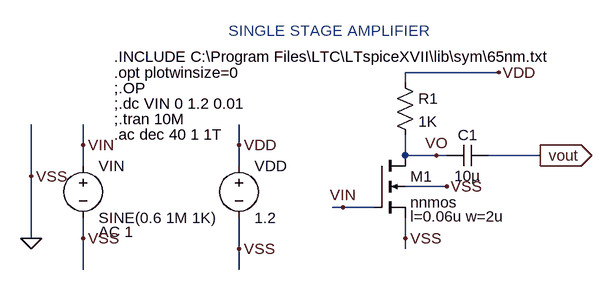
[diagram p0: schematic 8SINGLE STAGE AMPLIFIER.asc]
8SINGLE STAGE AMPLIFIER.asc, the LTspice schematic file:
Version 4
SHEET 1 880 680
WIRE 480 48 336 48
WIRE 336 64 336 48
WIRE -160 160 -160 128
WIRE 80 160 80 128
WIRE 336 176 336 144
WIRE 384 176 336 176
WIRE 400 176 384 176
WIRE 544 176 464 176
WIRE -160 192 -160 160
WIRE 80 192 80 160
WIRE -240 208 -240 128
WIRE 400 224 336 224
WIRE 240 256 224 256
WIRE 288 256 240 256
WIRE -240 304 -240 208
WIRE -160 304 -160 272
WIRE 336 304 336 272
WIRE 80 320 80 272
WIRE 336 320 336 304
WIRE -160 352 -160 304
WIRE 80 352 80 320
FLAG 544 176 vout
IOPIN 544 176 Out
FLAG -240 304 0
FLAG -240 208 VSS
FLAG -160 304 VSS
FLAG 80 320 VSS
FLAG 400 224 VSS
FLAG 336 304 VSS
FLAG 80 160 VDD
FLAG 480 48 VDD
FLAG -160 160 VIN
FLAG 240 256 VIN
FLAG 384 176 VO
SYMBOL nmos4 288 176 R0
WINDOW 123 56 94 Left 2
SYMATTR InstName M1
SYMATTR Value nnmos
SYMATTR Value2 l=0.06u w=2u
SYMBOL res 320 48 R0
SYMATTR InstName R1
SYMATTR Value 1K
SYMBOL cap 464 160 R90
WINDOW 0 0 32 VBottom 2
WINDOW 3 32 32 VTop 2
SYMATTR InstName C1
SYMATTR Value 10µ
SYMBOL voltage 80 176 R0
SYMATTR InstName VDD
SYMATTR Value 1.2
SYMBOL voltage -160 176 R0
WINDOW 123 24 118 Left 2
WINDOW 39 0 0 Left 0
SYMATTR InstName VIN
SYMATTR Value SINE(0.6 1M 1K)
SYMATTR Value2 AC 1
TEXT -112 24 Left 2 !.INCLUDE C:\\Program Files\\LTC\\LTspiceXVII\\lib\\sym\\65nm.txt
TEXT -112 48 Left 2 !.opt plotwinsize=0
TEXT -112 72 Left 2 !;.OP
TEXT -112 96 Left 2 !;.dc VIN 0 1.2 0.01
TEXT -112 120 Left 2 !;.tran 10M
TEXT -112 144 Left 2 !.ac dec 40 1 1T
TEXT 64 -16 Left 2 ;SINGLE STAGE AMPLIFIER

The netlist it stands for:
* 8SINGLE STAGE AMPLIFIER.asc
M1 VO VIN 0 0 nnmos l=0.06u w=2u
R1 VDD VO 1K
C1 vout VO 10µ
VDD VDD 0 1.2
VIN VIN 0 SINE(0.6 1M 1K) AC 1
.model NMOS NMOS
.model PMOS PMOS
.lib standard.mos
.INCLUDE C:\Program Files\LTC\LTspiceXVII\lib\sym\65nm.txt
.opt plotwinsize=0
;.OP
;.dc VIN 0 1.2 0.01
;.tran 10M
.ac dec 40 1 1T
* SINGLE STAGE AMPLIFIER
.backanno
.end